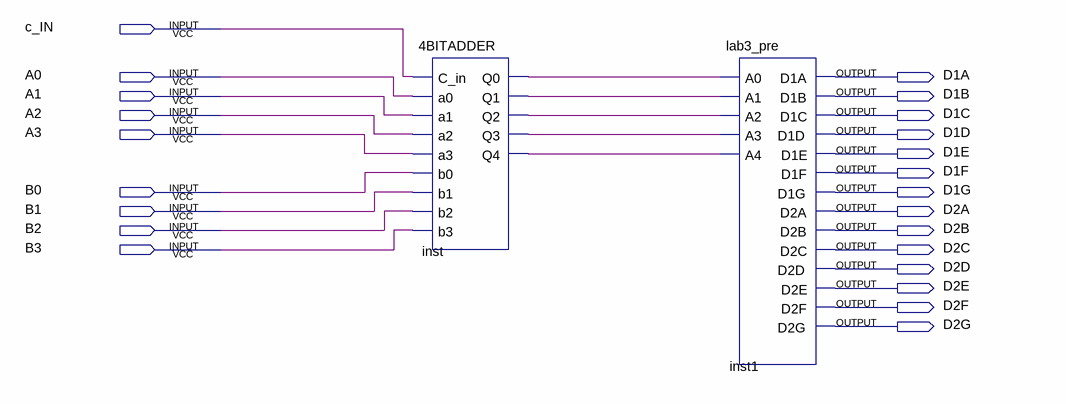
[diagram p0: schematic sheet]
// Quartus schematic main.bdf as structural Verilog: 2 symbols, 23 pins
module main (
  input  c_IN,
  input  A0,
  input  A1,
  input  A2,
  input  A3,
  input  B0,
  input  B1,
  input  B2,
  input  B3,
  output D1A,
  output D1B,
  output D1C,
  output D1D,
  output D1E,
  output D1F,
  output D1G,
  output D2A,
  output D2B,
  output D2C,
  output D2D,
  output D2E,
  output D2F,
  output D2G
);

  wire inst_q0, inst_q1, inst_q2, inst_q3, inst_q4;

  \4BITADDER  inst (
    .C_in(c_IN), .a0(A0), .a1(A1), .a2(A2), .a3(A3), .b0(B0), .b1(B1), .b2(B2), .b3(B3), .Q0(inst_q0),
    .Q1(inst_q1), .Q2(inst_q2), .Q3(inst_q3), .Q4(inst_q4));
  lab3_pre inst1 (
    .A0(inst_q0), .A1(inst_q1), .A2(inst_q2), .A3(inst_q3), .A4(inst_q4), .D1A(D1A), .D1B(D1B), .D1C(D1C),
    .D1D(D1D), .D1E(D1E), .D1F(D1F), .D1G(D1G), .D2A(D2A), .D2B(D2B), .D2C(D2C), .D2D(D2D), .D2E(D2E),
    .D2F(D2F), .D2G(D2G));
endmodule
